# Altium schematic sheet Interceptor_E1_sheet_1.SchDoc: {Наименование одна строка}
size 594 x 420 mm; SheetNumber: 1; SheetTotal: 1; Title1str: {Наименование}; PageSetup: Record=PageOptions|CenterHorizontal=False|CenterVertical=False|PrintScale=0.33|XCorrection=0.00|YCorrection=0.00|PrintKind=1|BorderSize=5000000|LeftOffset=0|BottomOffset=0|Orientation=1|PaperLength=1000|PaperWidth=1000|Scale=100|PaperSource=15|PrintQuality=600|MediaType=1|DitherType=10|PaperKind=A4|PrintScaleMode=1; Title2str: {Наименование}; DocumentType: Схема электрическая принципиальная; ImagePath: {Перв. применение}; Rule: PcbType=ProtelPcb
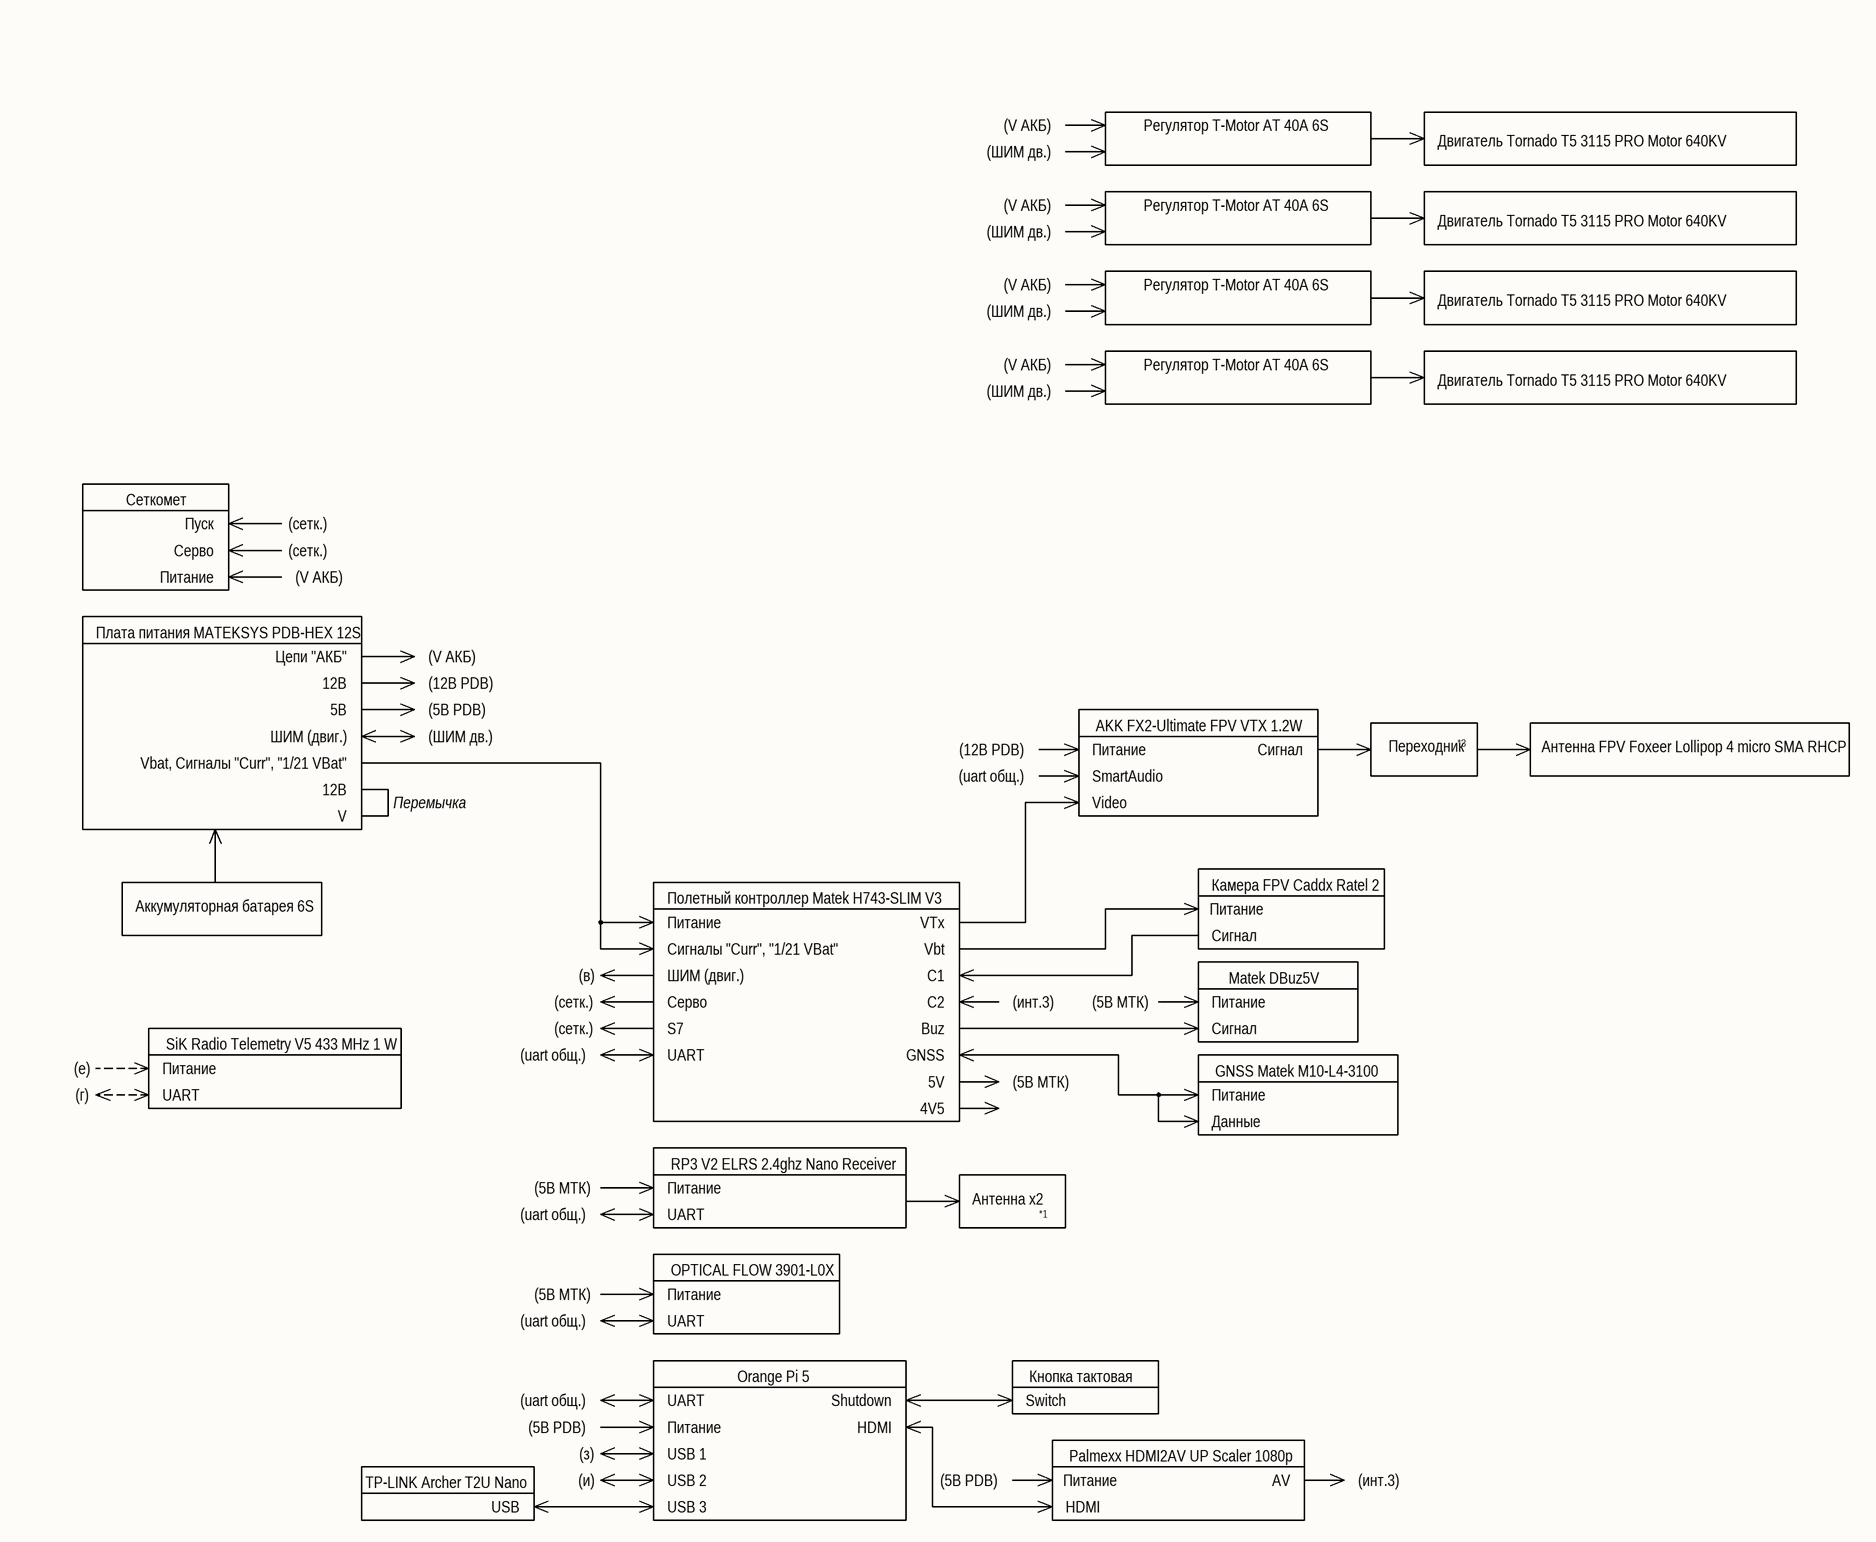
[diagram p0: Interceptor_E1_sheet_1.SchDoc, top left]
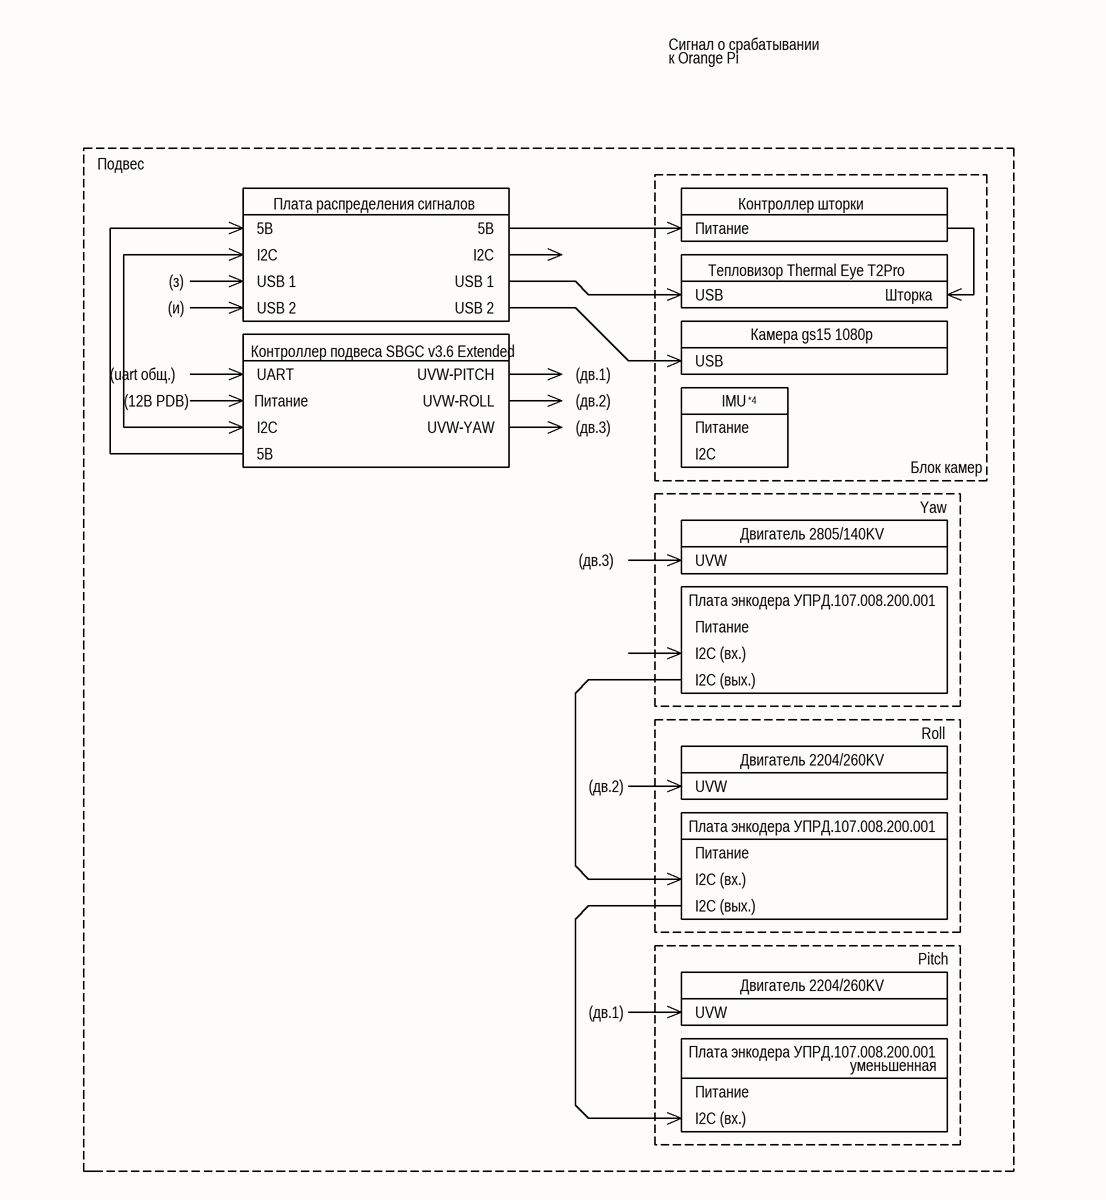
[diagram p1: Interceptor_E1_sheet_1.SchDoc, top right]
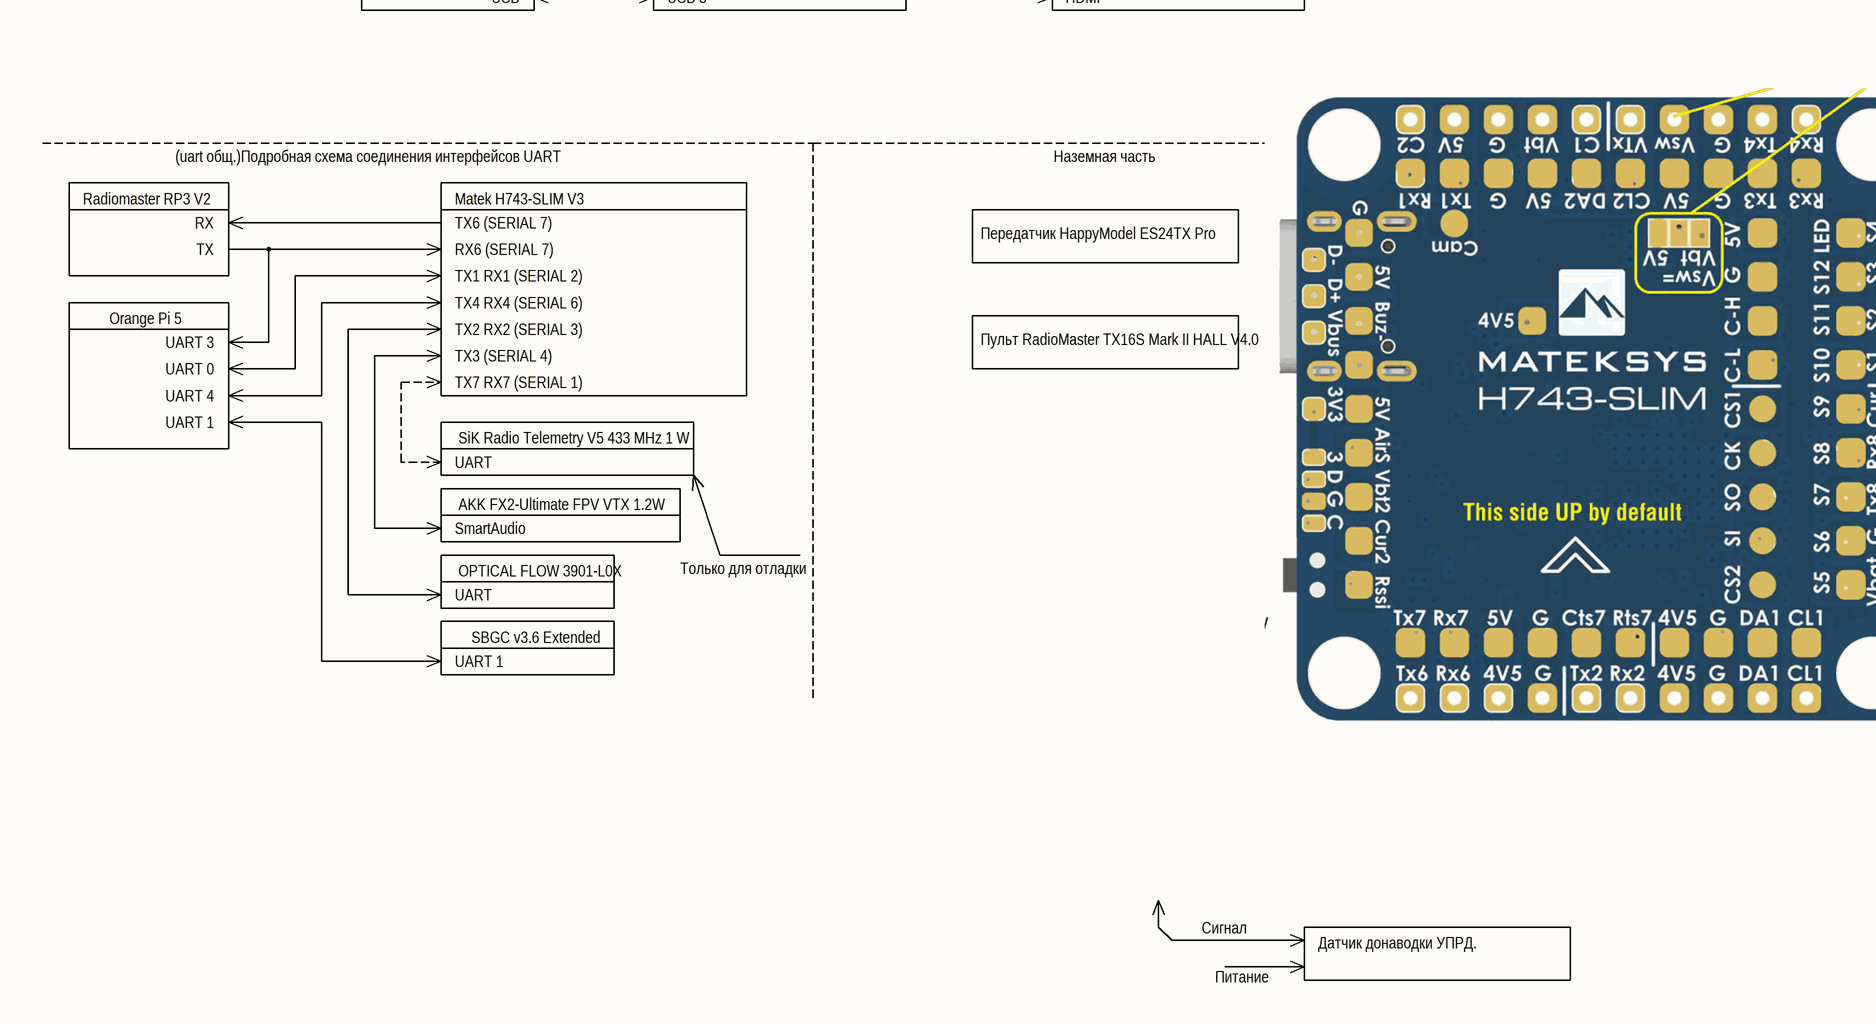
[diagram p2: Interceptor_E1_sheet_1.SchDoc, bottom left]
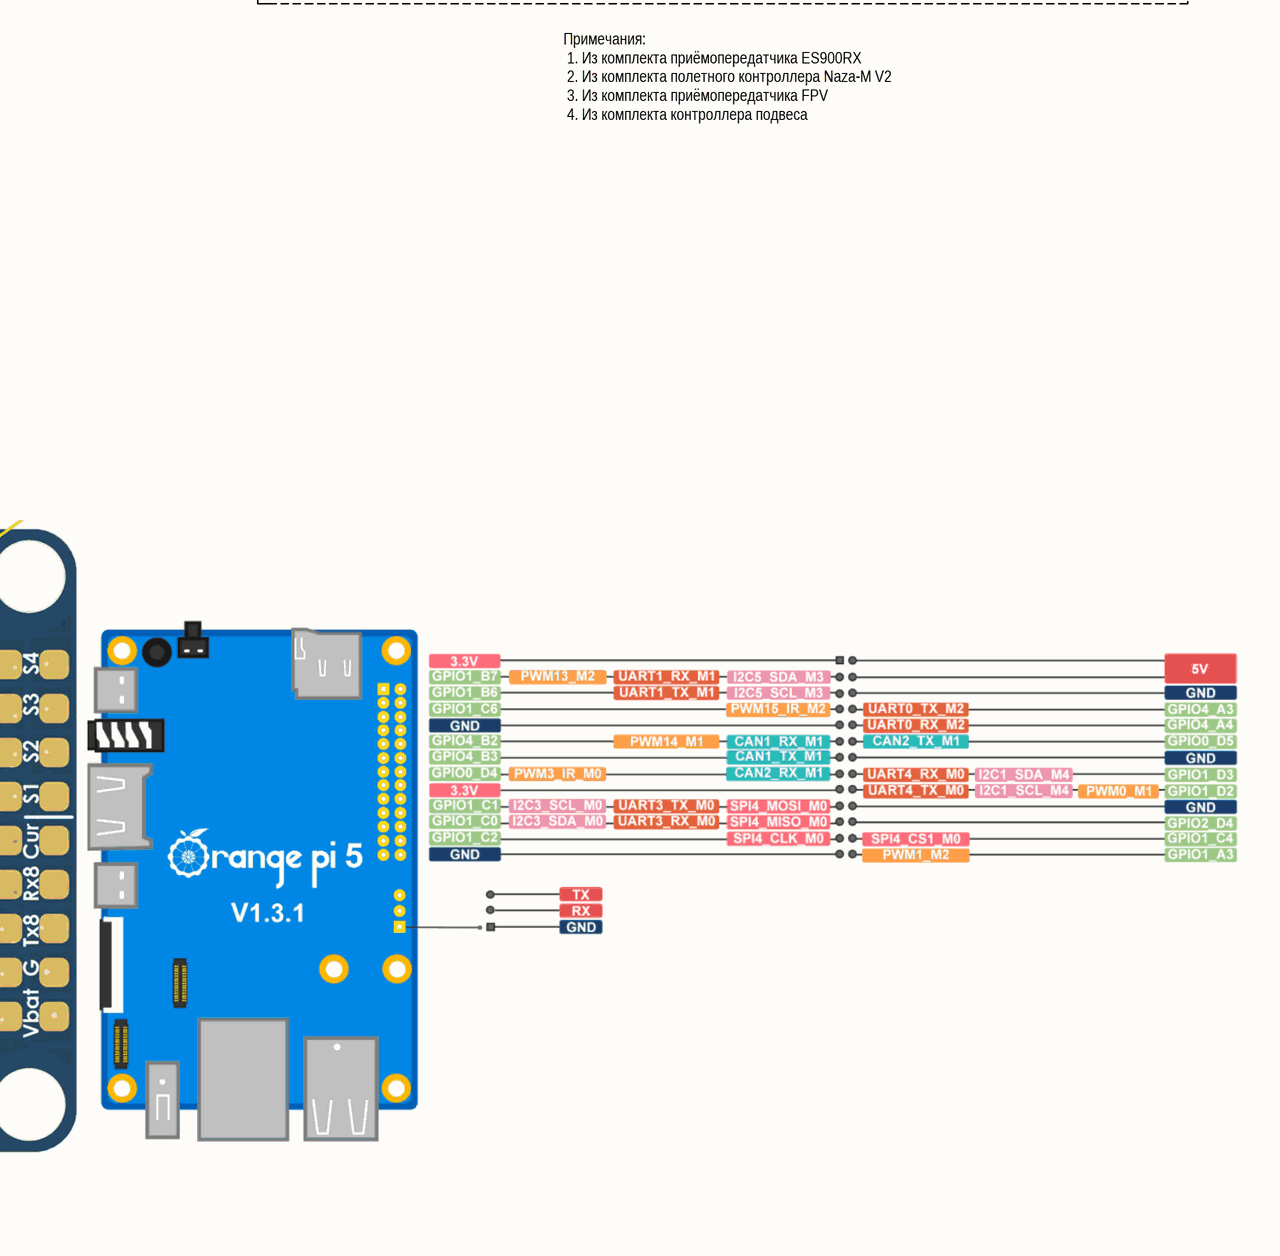
[diagram p3: Interceptor_E1_sheet_1.SchDoc, bottom right]

## Parts
A1  Плата распределения сигналов  (no BOM)
A2  Контроллер шторки  (no BOM)
A3  Регулятор T-Motor AT 40A 6S
A4  Двигатель Tornado T5 3115 PRO Motor 640KV
A5  Тепловизор Thermal Eye T2Pro
A6  Регулятор T-Motor AT 40A 6S
A7  Двигатель Tornado T5 3115 PRO Motor 640KV
A8  Камера gs15 1080p
A9  Контроллер подвеса SBGC v3.6 Extended
A10  Регулятор T-Motor AT 40A 6S
A11  Двигатель Tornado T5 3115 PRO Motor 640KV
A12  IMU  (no BOM)
A14  Регулятор T-Motor AT 40A 6S
A15  Двигатель Tornado T5 3115 PRO Motor 640KV
A17  Двигатель 2805/140KV
A18  Сеткомет  (no BOM)
A19  Плата энкодера УПРД.107.008.200.001  (no BOM)
A20  Плата питания MATEKSYS PDB-HEX 12S
A21  Двигатель 2204/260KV
A22  AKK FX2-Ultimate FPV VTX 1.2W
A23  Переходник  (no BOM)
A24  Антенна FPV Foxeer Lollipop 4 micro SMA RHCP  (no BOM)
A25  Плата энкодера УПРД.107.008.200.001  (no BOM)
A26  Аккумуляторная батарея 6S  (no BOM)
A27  Камера FPV Caddx Ratel 2
A28  Полетный контроллер Matek H743-SLIM V3
A29  Двигатель 2204/260KV
A30  SiK Radio Telemetry V5 433 MHz 1 W  (no BOM)
A31  Плата энкодера УПРД.107.008.200.001  (no BOM)
A32  Matek DBuz5V
A33  GNSS Matek M10-L4-3100
A34  RP3 V2 ELRS 2.4ghz Nano Receiver
A35  Антенна х2  (no BOM)
A36  OPTICAL FLOW 3901-L0X
A37  Orange Pi 5
A38  Кнопка тактовая
A40  Palmexx HDMI2AV UP Scaler 1080p
A41  TP-LINK Archer T2U Nano
A42  Передатчик HappyModel ES24TX Pro
A43  Пульт RadioMaster TX16S Mark II HALL V4.0
A44  SiK Radio Telemetry V5 433 MHz 1 W  (no BOM)
A45  AKK FX2-Ultimate FPV VTX 1.2W  (no BOM)
A46  OPTICAL FLOW 3901-L0X  (no BOM)
A47  SBGC v3.6 Extended  (no BOM)
A48  Датчик донаводки УПРД.  (no BOM)

## Notes on the sheet
- Сигнал о срабатывании
- к Orange Pi
- Подвес
- (V АКБ)
- (ШИМ дв.)
- I2C
- 5В
- Питание
- (з)
- (и)
- USB 1
- (near A9) USB 2
- USB 2
- USB
- Шторка
- (uart общ.)
- (12В PDB)
- UART
- UVW-ROLL
- UVW-PITCH
- (дв.1)
- (дв.2)
- (near A12) USB
- (near A12) *4
- UVW-YAW
- (дв.3)
- (near A12) Питание
- Блок камер
- Yaw
- UVW
- (near A20) Питание
- Пуск
- Серво
- (сетк.)
- (near A19) Питание
- I2C (вх.)
- I2C (вых.)
- Roll
- Цепи "АКБ"
- 12В
- (5В PDB)
- ШИМ (двиг.)
- Vbat, Сигналы "Curr", "1/21 VBat"
- (near A22) Питание
- SmartAudio
- Сигнал
- (near A23) *3
- (near A25) Питание
- V
- Перемычка
- Video
- Pitch
- (в)
- Сигналы "Curr", "1/21 VBat"
- VTx
- C1
- Vbt
- (near A32) Сигнал
- уменьшенная
- S7
- C2
- Buz
- GNSS
- (инт.3)
- (5В МТК)
- (near A33) Сигнал
- (г)
- (е)
- (near A30) Питание
- 5V
- 4V5
- (near A33) Питание
- Данные
- (near A34) Питание
- (near A35) *1
- (near A36) Питание
- Shutdown
- HDMI
- (near A38) Switch
- (near A41) USB
- USB 3
- (near A40) Питание
- AV
- Примечания:
  1. Из комплекта приёмопередатчика ES900RX
  2. Из комплекта полетного контроллера Naza-M V2
  3. Из комплекта приёмопередатчика FPV
  4. Из комплекта контроллера подвеса
- Radiomaster RP3 V2
- Подробная схема соединения интерфейсов UART
- Matek H743-SLIM V3
- (near A42) Наземная часть
- RX
- TX
- TX1 RX1 (SERIAL 2)
- TX6 (SERIAL 7)
- RX6 (SERIAL 7)
- Orange Pi 5
- UART 3
- TX4 RX4 (SERIAL 6)
- TX2 RX2 (SERIAL 3)
- TX3 (SERIAL 4)
- UART 4
- UART 0
- UART 1
- (near A44) TX7 RX7 (SERIAL 1)
- (near A46) SmartAudio
- Только для отладки
- (near A47) UART 1
- Перв. примен.
- Справ. №
- Подп. и дата
- Инв. № дубл.
- Взам. инв. №
- Изм.
- Лист
- № докум.
- Подп.
- Дата
- Лит.
- Масса
- Масштаб
- Пров.
- Т. контр.
- Разраб.
- Листов
- Инв. № подл.
- Н. контр.
- Версия
- Утв.
- Копировал
- Формат А2

## Library data of the parts
A1-A12 A14 A15 A17-A38 A40-A48 = CMP-ROOT-0839-2: Device; Manufacturer: *; HelpURL: *; Case: *; Temperature: *
  A1: Family: Модуль; Model: Плата распределения сигналов
  A2: Family: Модуль; Model: Контроллер шторки
  A3 A6 A10 A14: Family: Регулятор; Model: T-Motor AT 40A 6S
  A4 A7 A11 A15: Family: Двигатель; Model: Tornado T5 3115 PRO Motor 640KV
  A5: Family: Тепловизор; Model: Thermal Eye T2Pro
  A8: Family: Камера; Model: gs15 1080p
  A9: Family: Контроллер подвеса; Model: SBGC v3.6 Extended
  A12: Model: IMU
  A17: Family: Двигатель; Model: 2805/140KV
  A18: Model: Сеткомет
  A19 A25 A31: Family: Плата энкодера; Model: УПРД.107.008.200.001
  A20: Family: Плата питания; Model: MATEKSYS PDB-HEX 12S
  A21 A29: Family: Двигатель; Model: 2204/260KV
  A22 A45: Family: Передатчик; Model: AKK FX2-Ultimate FPV VTX 1.2W
  A23: Family: Переходник
  A24: Family: Антенна; Model: FPV Foxeer Lollipop 4 micro SMA RHCP
  A26: Family: Аккумуляторная батарея; Model: 6S
  A27: Family: Камера; Model: FPV Caddx Ratel 2
  A28: Family: Полетный контроллер; Model: Matek H743-SLIM V3
  A30 A44: Model: SiK Radio Telemetry V5 433 MHz 1 W
  A32: Family: Плата; Model: Matek DBuz5V
  A33: Family: Модуль; Model: GNSS Matek M10-L4-3100
  A34: Family: Передатчик; Model: RP3 V2 ELRS 2.4ghz Nano Receiver
  A35: Family: Антенна х2
  A36: Family: Модуль; Model: OPTICAL FLOW 3901-L0X
  A37: Family: Одноплатный компьютер; Model: Orange Pi 5
  A38: Family: Переключатель; Model: Кнопка тактовая
  A40: Family: Преобразователь; Model: Palmexx HDMI2AV UP Scaler 1080p
  A41: Family: Преобразователь; Model: TP-LINK Archer T2U Nano
  A42: Family: Передатчик; Model: HappyModel ES24TX Pro
  A43: Family: Пульт; Model: RadioMaster TX16S Mark II HALL V4.0
  A46: Model: OPTICAL FLOW 3901-L0X
  A47: Model: SBGC v3.6 Extended
  A48: Family: Датчик донаводки; Model: УПРД.